# Altium schematic sheet IMX_Analog Interface Circuit.SchDoc
size A4; SheetNumber: 7; SheetTotal: 8
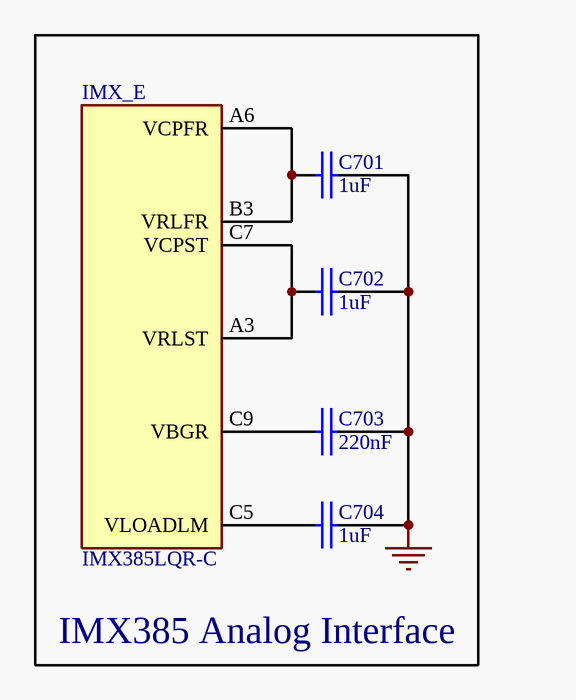
[diagram p0: IMX_Analog Interface Circuit.SchDoc]

## Parts
C701  1uF  [Capacitor, 0402]
C702  1uF  [Capacitor, 0402]
C703  220nF  [Capacitor, 0402]
C704  1uF  [Capacitor, 0402]
IMX_  IMX385LQR-C  [IMX385LQR]  (part E of 6)

## Blocks framed on the sheet
IMX385 Analog Interface: C701-C704 IMX_

## Nets
GND: C701.1 C702.1 C703.1 C704.2
NetC701_2: C701.2 IMX_.A6(VCPFR) IMX_.B3(VRLFR)
NetC702_2: C702.2 IMX_.A3(VRLST) IMX_.C7(VCPST)
NetC703_2: C703.2 IMX_.C9(VBGR)
NetC704_1: C704.1 IMX_.C5(VLOADLM)

## Library data of the parts
C701 C702 C704 = Capacitor, 0402, 1uF: Ceramic Capacitor, 10V, 10% +/- Tol, X7R, 1uF, SMD, 0402, #GRM155Z71A105KE01D, JLC#C528974; Capacitance: 1uF
C703 = Capacitor, 0402, 220nF: Ceramic Capacitor, 16V, 10% +/- Tol, X7R, 220nF, SMD, 0402, #CL05B224KO5NNNC, JLC#C16772; Capacitance: 220nF
IMX_ = IMX385LQR